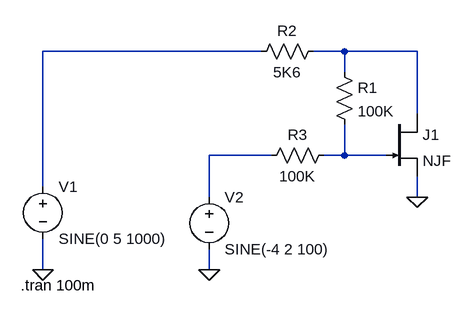
[diagram p0: schematic voltage_controlled_attenuator.asc]
voltage_controlled_attenuator.asc, the LTspice schematic file:
Version 4
SHEET 1 880 680
WIRE -64 48 -400 48
WIRE 64 48 16 48
WIRE 176 48 64 48
WIRE 64 80 64 48
WIRE 176 144 176 48
WIRE -48 208 -144 208
WIRE 64 208 64 160
WIRE 64 208 32 208
WIRE 128 208 64 208
WIRE -400 256 -400 48
WIRE -144 272 -144 208
WIRE 176 272 176 240
WIRE -400 384 -400 336
WIRE -144 384 -144 352
FLAG 176 272 0
FLAG -144 384 0
FLAG -400 384 0
SYMBOL njf 128 144 R0
SYMATTR InstName J1
SYMBOL res 48 64 R0
SYMATTR InstName R1
SYMATTR Value 100K
SYMBOL res 32 32 R90
WINDOW 0 0 56 VBottom 2
WINDOW 3 32 56 VTop 2
SYMATTR InstName R2
SYMATTR Value 5K6
SYMBOL res 48 192 R90
WINDOW 0 0 56 VBottom 2
WINDOW 3 32 56 VTop 2
SYMATTR InstName R3
SYMATTR Value 100K
SYMBOL voltage -400 240 R0
WINDOW 123 0 0 Left 2
WINDOW 39 0 0 Left 2
SYMATTR InstName V1
SYMATTR Value SINE(0 5 1000)
SYMBOL voltage -144 256 R0
WINDOW 123 0 0 Left 2
WINDOW 39 0 0 Left 2
SYMATTR InstName V2
SYMATTR Value SINE(-4 2 100)
TEXT -434 408 Left 2 !.tran 100m

The netlist it stands for:
* voltage_controlled_attenuator.asc
J1 N002 N004 0 NJF
R1 N002 N004 100K
R2 N002 N001 5K6
R3 N004 N003 100K
V1 N001 0 SINE(0 5 1000)
V2 N003 0 SINE(-4 2 100)
.model NJF NJF
.model PJF PJF
.lib standard.jft
.tran 100m
.backanno
.end